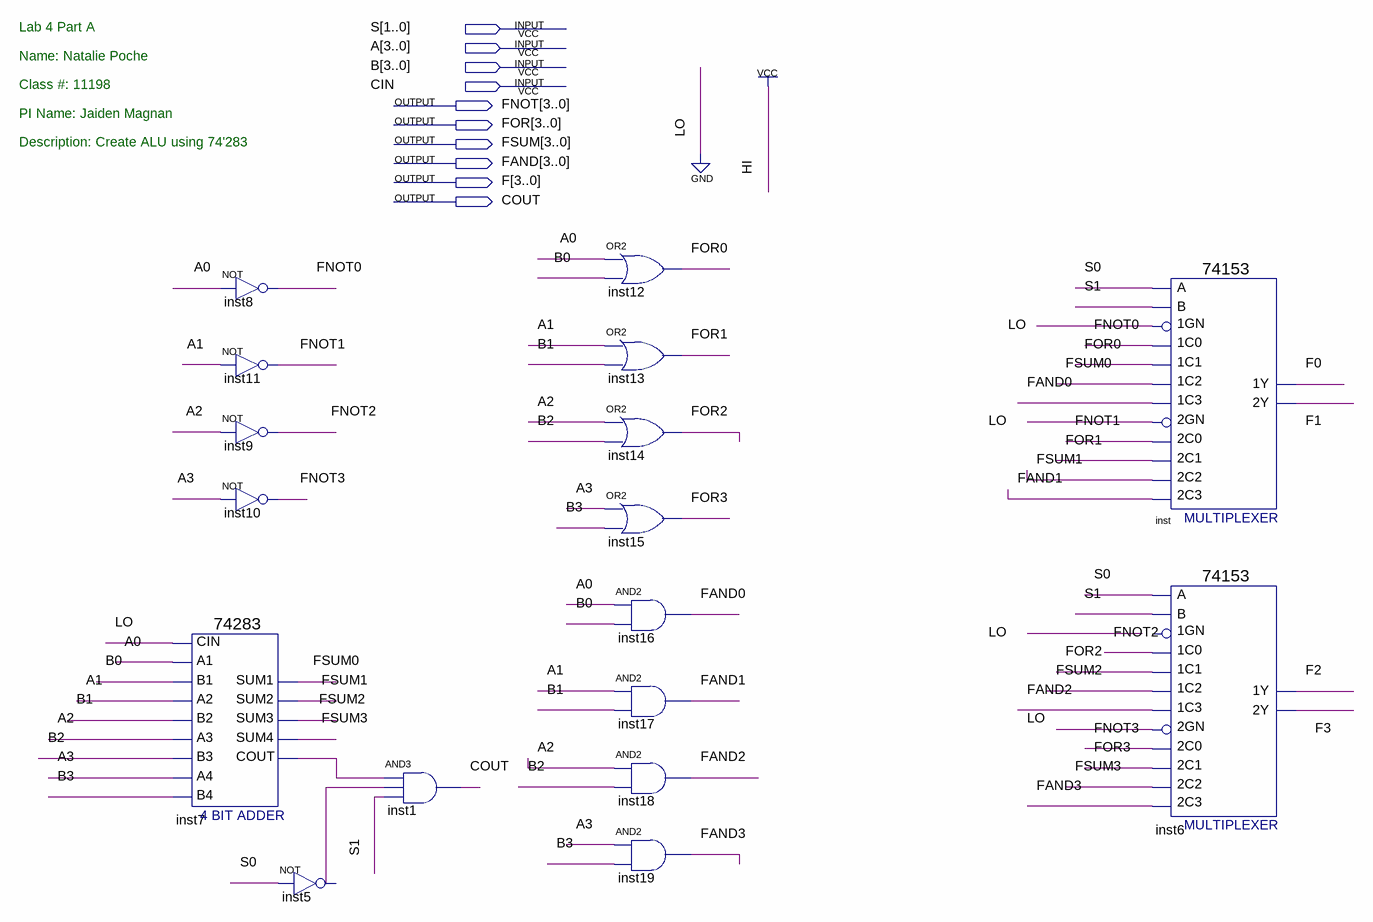
[diagram p0: schematic sheet]
// Quartus schematic Lab4_ALU.bdf as structural Verilog: 17 symbols, 10 pins
module Lab4_ALU (
  input  [1:0] S,
  input  [3:0] A,
  input  [3:0] B,
  input  CIN,
  output [3:0] FNOT,
  output [3:0] FOR,
  output [3:0] FSUM,
  output [3:0] FAND,
  output [3:0] F,
  output COUT
);

  wire inst5_out, inst7_cout;

  \74283  inst7 (
    .CIN(1'b0), .A1(A[0]), .A2(A[1]), .B2(B[1]), .A3(A[2]), .A4(A[3]), .B4(B[3]), .B1(B[0]), .B3(B[2]),
    .SUM4(FSUM[3]), .COUT(inst7_cout), .SUM1(FSUM[0]), .SUM2(FSUM[1]), .SUM3(FSUM[2]));
  not inst8 (FNOT[0], A[0]);
  not inst11 (FNOT[1], A[1]);
  not inst9 (FNOT[2], A[2]);
  not inst10 (FNOT[3], A[3]);
  not inst5 (inst5_out, S[0]);
  and inst1 (COUT, inst7_cout, inst5_out, S[1]);
  or inst12 (FOR[0], A[0], B[0]);
  or inst13 (FOR[1], A[1], B[1]);
  or inst14 (FOR[2], A[2], B[2]);
  or inst15 (FOR[3], A[3], B[3]);
  and inst16 (FAND[0], A[0], B[0]);
  and inst17 (FAND[1], A[1], B[1]);
  and inst18 (FAND[2], A[2], B[2]);
  and inst19 (FAND[3], A[3], B[3]);
  \74153  inst (
    .\1C1 (FOR[0]), .\1GN (1'b0), .\1C0 (FNOT[0]), .\2C0 (FNOT[1]), .\2GN (1'b0), .\2C2 (FSUM[1]),
    .\1C2 (FSUM[0]), .\1C3 (FAND[0]), .B(S[1]), .A(S[0]), .\2C1 (FOR[1]), .\2C3 (FAND[1]), .\1Y (F[0]),
    .\2Y (F[1]));
  \74153  inst6 (
    .\1C1 (FOR[2]), .\1C0 (FNOT[2]), .\2C0 (FNOT[3]), .\2GN (1'b0), .\2C2 (FSUM[3]), .\1C2 (FSUM[2]),
    .\1C3 (FAND[2]), .B(S[1]), .A(S[0]), .\2C1 (FOR[3]), .\2C3 (FAND[3]), .\1Y (F[2]), .\2Y (F[3]));  // open: 1GN

  // Notes on the sheet:
  //   Lab 4 Part A
  //   Name: Natalie Poche
  //   Class #: 11198
  //   PI Name: Jaiden Magnan
  //   Description: Create ALU using 74'283
endmodule
